# Altium schematic sheet My_PCB.SchDoc
size A2
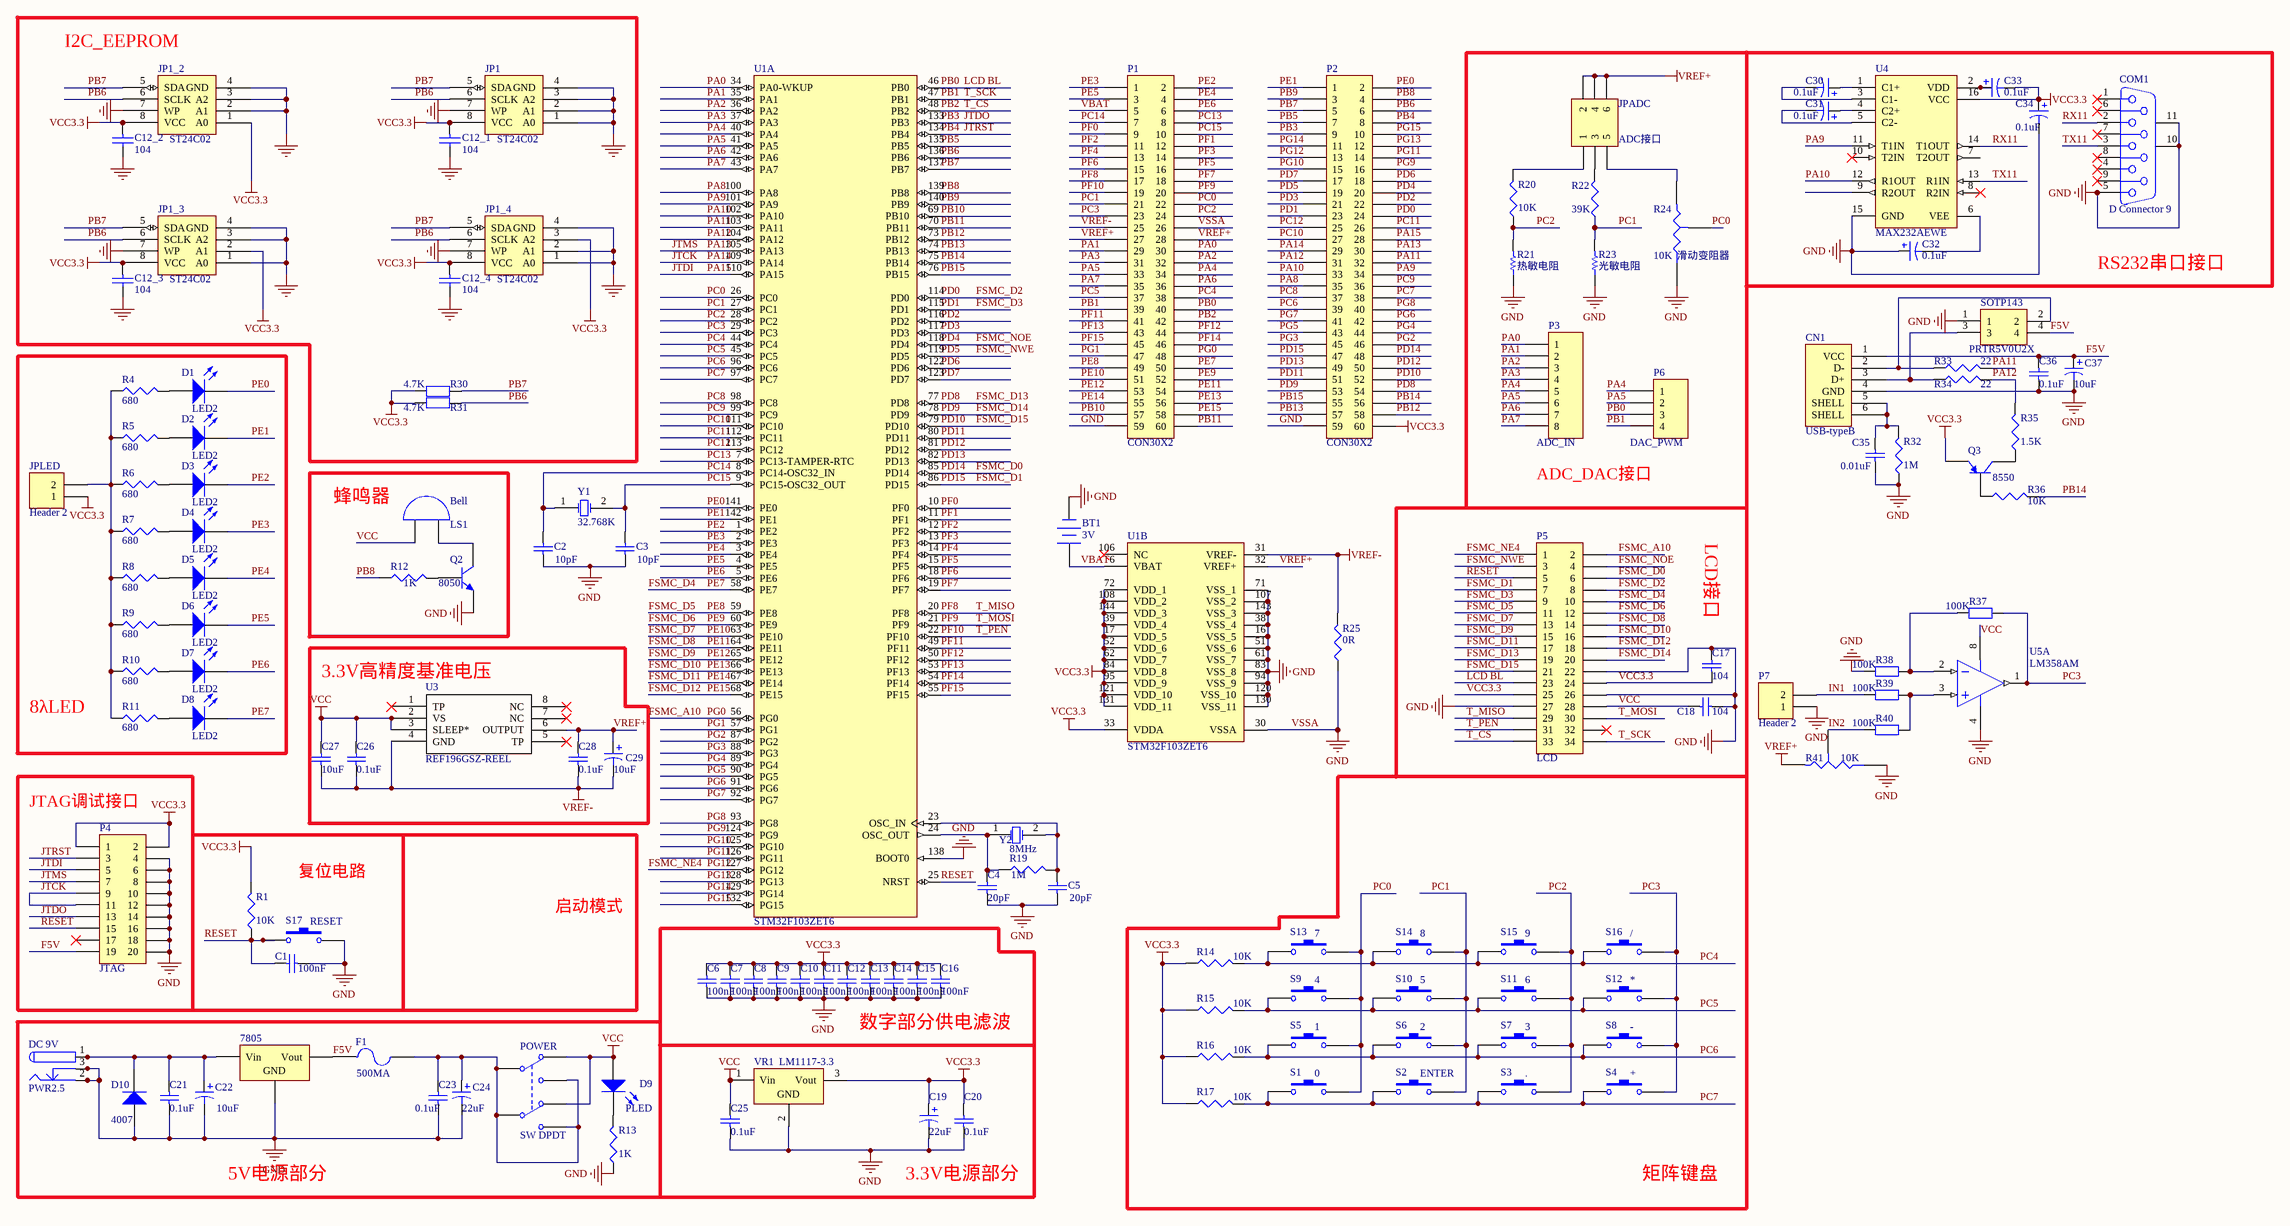
[diagram p0: My_PCB.SchDoc]

## Parts
7805  Volt Reg  [D2PAK_N]  (value not drawn)
BT1  3V  [BATTERY]
C1  value 100nF  [0805]  (hidden comment: Cap Semi)
C2  value 10pF  [0805]  (hidden comment: Cap Semi)
C3  value 10pF  [0805]  (hidden comment: Cap Semi)
C4  value 20pF  [0805]  (hidden comment: Cap Semi)
C5  value 20pF  [0805]  (hidden comment: Cap Semi)
C6  value 100nF  [0805]  (hidden comment: Cap Semi)
C7  value 100nF  [0805]  (hidden comment: Cap Semi)
C8  value 100nF  [0805]  (hidden comment: Cap Semi)
C9  value 100nF  [0805]  (hidden comment: Cap Semi)
C10  value 100nF  [0805]  (hidden comment: Cap Semi)
C11  value 100nF  [0805]  (hidden comment: Cap Semi)
C12  value 100nF  [0805]  (hidden comment: Cap Semi)
C12_1  104  [0805]
C12_2  104  [0805]
C12_3  104  [0805]
C12_4  104  [0805]
C13  value 100nF  [0805]  (hidden comment: Cap Semi)
C14  value 100nF  [0805]  (hidden comment: Cap Semi)
C15  value 100nF  [0805]  (hidden comment: Cap Semi)
C16  value 100nF  [0805]  (hidden comment: Cap Semi)
C17  value 104  [0805]  (hidden comment: Cap Semi)
C18  value 104  [0805]  (hidden comment: Cap Semi)
C19  value 22uF  [0805]  (hidden comment: Cap Pol3)
C20  value 0.1uF  [0805]  (hidden comment: Cap Semi)
C21  value 0.1uF  [0805]  (hidden comment: Cap Semi)
C22  value 10uF  [0805]  (hidden comment: Cap Pol3)
C23  value 0.1uF  [0805]  (hidden comment: Cap Semi)
C24  value 22uF  [0805]  (hidden comment: Cap Pol3)
C25  value 0.1uF  [0805]  (hidden comment: Cap Semi)
C26  value 0.1uF  [0805]  (hidden comment: Cap Semi)
C27  value 10uF  [0805]  (hidden comment: Cap Semi)
C28  value 0.1uF  [0805]  (hidden comment: Cap Semi)
C29  value 10uF  [0805]  (hidden comment: Cap Pol3)
C30  value 0.1uF  [0805]  (hidden comment: Cap Pol3)
C31  value 0.1uF  [0805]  (hidden comment: Cap Pol3)
C32  value 0.1uF  [0805]  (hidden comment: Cap Pol3)
C33  value 0.1uF  [0805]  (hidden comment: Cap Pol3)
C34  value 0.1uF  [0805]  (hidden comment: Cap Pol3)
C35  value 0.01uF  [0805]  (hidden comment: Cap)
C36  value 0.1uF  [0805]  (hidden comment: Cap)
C37  value 10uF  [0805]  (hidden comment: Cap Pol1)
CN1  USB-typeB  [USB-B]
COM1  D Connector 9  [DSUB1.385-2H9]
D1  LED2  [3.2X1.6X1.1]
D2  LED2  [3.2X1.6X1.1]
D3  LED2  [3.2X1.6X1.1]
D4  LED2  [3.2X1.6X1.1]
D5  LED2  [3.2X1.6X1.1]
D6  LED2  [3.2X1.6X1.1]
D7  LED2  [3.2X1.6X1.1]
D8  LED2  [3.2X1.6X1.1]
D9  PLED  [3.2X1.6X1.1]
D10  4007  [DO-41]
DC_9V  PWR2.5  [KLD-0202]
F1  500MA  [PIN-W2/E2.8]
JP1  ST24C02  [SO8]
JP1_2  ST24C02  [SO8]
JP1_3  ST24C02  [SO8]
JP1_4  ST24C02  [SO8]
JPADC  ADC接口  [HDR2X3]
JPLED  Header 2  [HDR1X2]
LS1  Bell  [BELL]
P1  CON30X2  [HDR2X30]
P2  CON30X2  [HDR2X30]
P3  ADC_IN  [HDR1X8]
P4  JTAG  [HDR2X10]
P5  LCD  [HDR2X17]
P6  DAC_PWM  [HDR1X4]
P7  Header 2  [HDR1X2]
POWER  SW DPDT  [DPDT-6]
Q2  8050  [TO-226-AA]
Q3  8550  [TO-92A]
R1  value 10K  [0805]  (hidden comment: Res3)
R4  value 680  [0805]  (hidden comment: Res3)
R5  value 680  [0805]  (hidden comment: Res3)
R6  value 680  [0805]  (hidden comment: Res3)
R7  value 680  [0805]  (hidden comment: Res3)
R8  value 680  [0805]  (hidden comment: Res3)
R9  value 680  [0805]  (hidden comment: Res3)
R10  value 680  [0805]  (hidden comment: Res3)
R11  value 680  [0805]  (hidden comment: Res3)
R12  value 1K  [0805]  (hidden comment: Res3)
R13  value 1K  [0805]  (hidden comment: Res3)
R14  value 10K  [0805]  (hidden comment: Res3)
R15  value 10K  [0805]  (hidden comment: Res3)
R16  value 10K  [0805]  (hidden comment: Res3)
R17  value 10K  [0805]  (hidden comment: Res3)
R19  value 1M  [0805]  (hidden comment: Res3)
R20  value 10K  [0805]  (hidden comment: Res3)
R21  热敏电阻  [AXIAL-0.5]
R22  value 39K  [0805]  (hidden comment: Res3)
R23  光敏电阻  [AXIAL-0.5]
R24  滑动变阻器  value 10K  [VR5]
R25  value 0R  [0805]  (hidden comment: Res3)
R30  value 4.7K  [0805]  (hidden comment: 10K)
R31  value 4.7K  [0805]  (hidden comment: 10K)
R32  value 1M  [0805]  (hidden comment: Res3)
R33  value 22  [0805]  (hidden comment: Res3)
R34  value 22  [0805]  (hidden comment: Res3)
R35  value 1.5K  [0805]  (hidden comment: Res3)
R36  value 10K  [0805]  (hidden comment: Res3)
R37  value 100K  [0805]  (hidden comment: Res2)
R38  value 100K  [0805]  (hidden comment: Res2)
R39  value 100K  [0805]  (hidden comment: Res2)
R40  value 100K  [0805]  (hidden comment: Res2)
R41  value 10K  [VR5]  (hidden comment: Res Tap)
S1  0  [KEYSB1]
S2  ENTER  [KEYSB1]
S3  .  [KEYSB1]
S4  +  [KEYSB1]
S5  1  [KEYSB1]
S6  2  [KEYSB1]
S7  3  [KEYSB1]
S8  -  [KEYSB1]
S9  4  [KEYSB1]
S10  5  [KEYSB1]
S11  6  [KEYSB1]
S12  *  [KEYSB1]
S13  7  [KEYSB1]
S14  8  [KEYSB1]
S15  9  [KEYSB1]
S16  /  [KEYSB1]
S17  RESET  [KEYSB1]
SOTP143  PRTR5V0U2X  [SOT-143_N]
U1  STM32F103ZET6  [LQFP144_N]  (parts A,B of 2)
U3  REF196GSZ-REEL  [R_8]
U4  MAX232AEWE  [WSO16_L]
U5  LM358AM  [M08A_N]  (part A of 2)
VR1_LM1117-3.3  Volt Reg  [LM1117]  (value not drawn)
Y1  32.768K  [R38]
Y2  8MHz  [XTAL]

## Blocks framed on the sheet
I2C_EEPROM: C12_1-C12_4 JP1 JP1_2-JP1_4 R30 R31
ADC_DAC接口: JPADC P3 P6 R20-R24
8λLED: D1-D8 JPLED R4-R11
蜂鸣器: LS1 Q2 R12
LCD接口: C17 C18 P5
3.3V高精度基准电压: C26-C29 U3
JTAG调试接口: P4
矩阵键盘: R14-R17 S1-S16
5V电源部分: 7805 C21-C24 D9 D10 DC_9V F1 POWER R13

## Nets
GND: 7805.2(GND) BT1.2(-) C1.1 C2.1 C3.1 C4.1 C5.1 C6.1 C7.1 C8.1 C9.1 C10.1 C11.1 C12.1 C12_1.2 C12_2.2 C12_3.2 C12_4.2 C13.1 C14.1 C15.1 C16.1 C17.2 C18.1 C19.2 C20.1 C21.1 C22.2 C23.1 C24.2 C25.1 C32.1 C34.2 C35.1 C36.1 C37.2 CN1.4(GND) COM1.5 COM1.10(MH1) COM1.11(MH2) D10.1(A) DC_9V.2 DC_9V.2A DC_9V.2B DC_9V.3 DC_9V.3A DC_9V.3B JP1.1(A0) JP1.2(A1) JP1.3(A2) JP1.4(GND) JP1.7(WP) JP1_2.2(A1) JP1_2.3(A2) JP1_2.4(GND) JP1_2.7(WP) JP1_3.1(A0) JP1_3.3(A2) JP1_3.4(GND) JP1_3.7(WP) JP1_4.1(A0) JP1_4.2(A1) JP1_4.4(GND) JP1_4.7(WP) P1.26 P1.59 P2.59 P4.4 P4.6 P4.8 P4.10 P4.12 P4.14 P4.16 P4.18 P4.20 P5.22 P5.26 P5.27 P7.1 Q2.3(E) R13.1 R21.1 R23.1 R24.2(B) R25.1 R32.1 R38.1 R41.2(B) S17.2 SOTP143.1 U1.16(VSS_5) U1.30(VSSA) U1.38(VSS_4) U1.51(VSS_6) U1.61(VSS_7) U1.71(VSS_1) U1.83(VSS_8) U1.94(VSS_9) U1.107(VSS_2) U1.120(VSS_10) U1.130(VSS_11) U1.138(BOOT0) U1.143(VSS_3) U4.15(GND) U5.4(GND) VR1_LM1117-3.3.2(GND)  [also labelled VSSA]
VCC: C18.2 C25.2 C26.2 C27.2 D9.1(A) LS1.1(A) P5.28 POWER.2(NC1) POWER.4(NC2) U3.2(VS) U3.3(SLEEP*) U5.8(V+) VR1_LM1117-3.3.1(Vin)
VCC3.3: C6.2 C7.2 C8.2 C9.2 C10.2 C11.2 C12.2 C12_1.1 C12_2.1 C12_3.1 C12_4.1 C13.2 C14.2 C15.2 C16.2 C17.1 C19.1 C20.2 C33.2 C34.1 JP1.8(VCC) JP1_2.1(A0) JP1_2.8(VCC) JP1_3.2(A1) JP1_3.8(VCC) JP1_4.3(A2) JP1_4.8(VCC) JPLED.1 P2.60 P4.1 P4.2 P5.24 P5.25 Q3.1(E) R1.2 R14.1 R15.1 R16.1 R17.1 R30.1 R31.1 U1.17(VDD_5) U1.33(VDDA) U1.39(VDD_4) U1.52(VDD_6) U1.62(VDD_7) U1.72(VDD_1) U1.84(VDD_8) U1.95(VDD_9) U1.108(VDD_2) U1.121(VDD_10) U1.131(VDD_11) U1.144(VDD_3) U4.16(VCC) VR1_LM1117-3.3.3(Vout)
VREF+: C28.2 C29.1 JPADC.2 JPADC.4 JPADC.6 P1.27 P1.28 R41.1(A) U1.32(VREF+) U3.6(OUTPUT)
VREF-: C26.1 C27.1 C28.1 C29.2 P1.25 R25.2 U1.31(VREF-) U3.4(GND)
F5V: 7805.3(Vout) C36.2 C37.1 CN1.1(VCC) F1.1 P4.19 SOTP143.4
FSMC_A10: P1.48 P5.2 U1.56(PG0)  [also labelled PG0]
FSMC_D0: P2.48 P5.6 U1.85(PD14)  [also labelled PD14]
FSMC_D1: P2.47 P5.7 U1.86(PD15)  [also labelled PD15]
FSMC_D2: P2.24 P5.8 U1.114(PD0)  [also labelled PD0]
FSMC_D3: P2.23 P5.9 U1.115(PD1)  [also labelled PD1]
FSMC_D4: D8.2(K) P1.50 P5.10 U1.58(PE7)  [also labelled PE7]
FSMC_D5: P1.49 P5.11 U1.59(PE8)  [also labelled PE8]
FSMC_D6: P1.52 P5.12 U1.60(PE9)  [also labelled PE9]
FSMC_D7: P1.51 P5.13 U1.63(PE10)  [also labelled PE10]
FSMC_D8: P1.54 P5.14 U1.64(PE11)  [also labelled PE11]
FSMC_D9: P1.53 P5.15 U1.65(PE12)  [also labelled PE12]
FSMC_D10: P1.56 P5.16 U1.66(PE13)  [also labelled PE13]
FSMC_D11: P1.55 P5.17 U1.67(PE14)  [also labelled PE14]
FSMC_D12: P1.58 P5.18 U1.68(PE15)  [also labelled PE15]
FSMC_D13: P2.54 P5.19 U1.77(PD8)  [also labelled PD8]
FSMC_D14: P2.53 P5.20 U1.78(PD9)  [also labelled PD9]
FSMC_D15: P2.52 P5.21 U1.79(PD10)  [also labelled PD10]
FSMC_NE4: P2.13 P5.1 U1.127(PG12)  [also labelled PG12]
FSMC_NOE: P2.20 P5.4 U1.118(PD4)  [also labelled PD4]
FSMC_NWE: P2.19 P5.3 U1.119(PD5)  [also labelled PD5]
IN1: P7.2 R39.1
IN2: R40.1 R41.3(TAP)
JTCK: P2.29 P4.9 P4.11 U1.109(PA14)  [also labelled PA14]
JTDI: P2.28 P4.5 U1.110(PA15)  [also labelled PA15]
JTDO: P2.9 P4.13 U1.133(PB3)  [also labelled PB3]
JTMS: P2.30 P4.7 U1.105(PA13)  [also labelled PA13]
JTRST: P2.8 P4.3 U1.134(PB4)  [also labelled PB4]
LCD BL: P1.40 P5.23 P6.3 U1.46(PB0)  [also labelled PB0]
PA0: P1.30 P3.1 U1.34(PA0-WKUP)
PA1: P1.29 P3.2 U1.35(PA1)
PA2: P1.32 P3.3 U1.36(PA2)
PA3: P1.31 P3.4 U1.37(PA3)
PA4: P1.34 P3.5 P6.1 U1.40(PA4)
PA5: P1.33 P3.6 P6.2 U1.41(PA5)
PA6: P1.36 P3.7 U1.42(PA6)
PA7: P1.35 P3.8 U1.43(PA7)
PA8: P2.35 U1.100(PA8)
PA9: P2.34 U1.101(PA9) U4.11(T1IN)
PA10: P2.33 U1.102(PA10) U4.12(R1OUT)
PA11: P2.32 R33.2 U1.103(PA11)
PA12: P2.31 R34.2 R35.2 U1.104(PA12)
PB1: P1.39 P5.34 P6.4 U1.47(PB1)  [also labelled T_SCK]
PB2: P1.42 P5.33 U1.48(PB2)  [also labelled T_CS]
PB5: P2.7 U1.135(PB5)
PB6: JP1.6(SCLK) JP1_2.6(SCLK) JP1_3.6(SCLK) JP1_4.6(SCLK) P2.6 R31.2 U1.136(PB6)
PB7: JP1.5(SDA) JP1_2.5(SDA) JP1_3.5(SDA) JP1_4.5(SDA) P2.5 R30.2 U1.137(PB7)
PB8: P2.4 R12.1 U1.139(PB8)
PB9: P2.3 U1.140(PB9)
PB10: P1.57 U1.69(PB10)
PB11: P1.60 U1.70(PB11)
PB12: P2.58 U1.73(PB12)
PB13: P2.57 U1.74(PB13)
PB14: P2.56 R36.2 U1.75(PB14)
PB15: P2.55 U1.76(PB15)
PC0: P1.22 R24.3(TAP) S1.2 S5.2 S9.2 S13.2 U1.26(PC0)
PC1: P1.21 R22.1 R23.2 S2.2 S6.2 S10.2 S14.2 U1.27(PC1)
PC2: P1.24 R20.1 R21.2 S3.2 S7.2 S11.2 S15.2 U1.28(PC2)
PC3: P1.23 R37.2 S4.2 S8.2 S12.2 S16.2 U1.29(PC3) U5.1(OUTA)
PC4: P1.38 R14.2 S13.1 S14.1 S15.1 S16.1 U1.44(PC4)
PC5: P1.37 R15.2 S9.1 S10.1 S11.1 S12.1 U1.45(PC5)
PC6: P2.39 R16.2 S5.1 S6.1 S7.1 S8.1 U1.96(PC6)
PC7: P2.38 R17.2 S1.1 S2.1 S3.1 S4.1 U1.97(PC7)
PC8: P2.37 U1.98(PC8)
PC9: P2.36 U1.99(PC9)
PC10: P2.27 U1.111(PC10)
PC11: P2.26 U1.112(PC11)
PC12: P2.25 U1.113(PC12)
PC13: P1.8 U1.7(PC13-TAMPER-RTC)
PC14: C2.2 P1.7 U1.8(PC14-OSC32_IN) Y1.1(OSC1)
PC15: C3.2 P1.10 U1.9(PC15-OSC32_OUT) Y1.2(OSC2)
PD2: P2.22 U1.116(PD2)
PD3: P2.21 U1.117(PD3)
PD6: P2.18 U1.122(PD6)
PD7: P2.17 U1.123(PD7)
PD11: P2.51 U1.80(PD11)
PD12: P2.50 U1.81(PD12)
PD13: P2.49 U1.82(PD13)
PE0: D1.2(K) P2.2 U1.141(PE0)
PE1: D2.2(K) P2.1 U1.142(PE1)
PE2: D3.2(K) P1.2 U1.1(PE2)
PE3: D4.2(K) P1.1 U1.2(PE3)
PE4: D5.2(K) P1.4 U1.3(PE4)
PE5: D6.2(K) P1.3 U1.4(PE5)
PE6: D7.2(K) P1.6 U1.5(PE6)
PF0: P1.9 U1.10(PF0)
PF1: P1.12 U1.11(PF1)
PF2: P1.11 U1.12(PF2)
PF3: P1.14 U1.13(PF3)
PF4: P1.13 U1.14(PF4)
PF5: P1.16 U1.15(PF5)
PF6: P1.15 U1.18(PF6)
PF7: P1.18 U1.19(PF7)
PF8: P1.17 P5.29 U1.20(PF8)  [also labelled T_MISO]
PF9: P1.20 P5.30 U1.21(PF9)  [also labelled T_MOSI]
PF10: P1.19 P5.31 U1.22(PF10)  [also labelled T_PEN]
PF11: P1.41 U1.49(PF11)
PF12: P1.44 U1.50(PF12)
PF13: P1.43 U1.53(PF13)
PF14: P1.46 U1.54(PF14)
PF15: P1.45 U1.55(PF15)
PG1: P1.47 U1.57(PG1)
PG2: P2.46 U1.87(PG2)
PG3: P2.45 U1.88(PG3)
PG4: P2.44 U1.89(PG4)
PG5: P2.43 U1.90(PG5)
PG6: P2.42 U1.91(PG6)
PG7: P2.41 U1.92(PG7)
PG8: P2.40 U1.93(PG8)
PG9: P2.16 U1.124(PG9)
PG10: P2.15 U1.125(PG10)
PG11: P2.14 U1.126(PG11)
PG13: P2.12 U1.128(PG13)
PG14: P2.11 U1.129(PG14)
PG15: P2.10 U1.132(PG15)
RESET: C1.2 P4.15 P5.5 R1.1 S17.1 U1.25(NRST)
RX11: COM1.2 U4.14(T1OUT)
TX11: COM1.3 U4.13(R1IN)
VBAT: BT1.1(+) P1.5 U1.6(VBAT)
Net7805_1: 7805.1(Vin) C21.2 C22.1 D10.2(K) DC_9V.1 DC_9V.1A DC_9V.1B
NetC4_2: C4.2 R19.1 U1.24(OSC_OUT) Y2.1(OSC1)
NetC5_2: C5.2 R19.2 U1.23(OSC_IN) Y2.2(OSC2)
NetC23_2: C23.2 C24.1 F1.2 POWER.1(COMMON1) POWER.3(NO1) POWER.5(COMMON2) POWER.6(NO2)
NetC30_1: C30.1 U4.1(C1+)
NetC30_2: C30.2 U4.3(C1-)
NetC31_1: C31.1 U4.4(C2+)
NetC31_2: C31.2 U4.5(C2-)
NetC32_2: C32.2 U4.6(VEE)
NetC33_1: C33.1 U4.2(VDD)
NetC35_2: C35.2 CN1.5(SHELL) CN1.6(SHELL) R32.2
NetCN1_2: CN1.2(D-) R33.1 SOTP143.2
NetCN1_3: CN1.3(D+) R34.1 SOTP143.3
NetD1_1: D1.1(A) R4.2
NetD2_1: D2.1(A) R5.2
NetD3_1: D3.1(A) R6.2
NetD4_1: D4.1(A) R7.2
NetD5_1: D5.1(A) R8.2
NetD6_1: D6.1(A) R9.2
NetD7_1: D7.1(A) R10.2
NetD8_1: D8.1(A) R11.2
NetD9_2: D9.2(K) R13.2
NetJPADC_1: JPADC.1 R20.2
NetJPADC_3: JPADC.3 R22.2
NetJPADC_5: JPADC.5 R24.1(A)
NetJPLED_2: JPLED.2 R4.1 R5.1 R6.1 R7.1 R8.1 R9.1 R10.1 R11.1
NetLS1_2: LS1.2(B) Q2.1(C)
NetQ2_2: Q2.2(B) R12.2
NetQ3_2: Q3.2(B) R36.1
NetQ3_3: Q3.3(C) R35.1
NetR37_1: R37.1 R38.2 U5.2(INA-)
NetR39_2: R39.2 R40.2 U5.3(INA+)

Not connected (* = marked no-connect by the designer): COM1 1* 4* 6* 7* 8* 9*; P4 17*; P5 32*; U1 106(NC)*; U3 1(TP)* 5(TP)* 7(NC)* 8(NC)*; U4 7(T2OUT) 8(R2IN)* 9(R2OUT) 10(T2IN)*

## Notes on the sheet
- RS232串口接口
- 复位电路
- 启动模式
- 数字部分供电滤波
- 3.3V电源部分

## Library data of the parts
7805 = Volt Reg: Voltage Regulator; Published: 24-Mar-1999; LatestRevisionDate: 29-May-2009; LatestRevisionNote: IPC-7351 Footprint Added.; PackageReference: D2PAK; Publisher: Altium Limited; PackageDescription: 3-Pin Transistor Outline Package 2.54 mm Pitch, 15.1 mm Lead Span
BT1 = Battery: Multicell Battery; Published: 24-Mar-1999; LatestRevisionDate: 17-Jul-2002; LatestRevisionNote: Re-released for DXP Platform.; PackageReference: BAT-2; Publisher: Altium Limited; PackageDescription: Battery; 2 Leads
C1-C18 C20 C21 C23 C25-C28 = Cap Semi: Capacitor (Semiconductor SIM Model); Published: 8-Jun-2000; LatestRevisionDate: 29-May-2009; LatestRevisionNote: IPC-7351 Footprint Added.; PackageReference: C1206; Publisher: Altium Limited; PackageDescription: Chip Capacitor
C12_1-C12_4 = CAP: Capacitor
C19 C22 C24 C29-C34 = Cap Pol3: Polarized Capacitor (Surface Mount); Published: 8-Jun-2000; LatestRevisionDate: 29-May-2009; LatestRevisionNote: IPC-7351 Footprint Added.; PackageReference: C0805; Publisher: Altium Limited; PackageDescription: Chip Capacitor
C35 C36 = Cap: Capacitor; Published: 8-Jun-2000; LatestRevisionDate: 17-Jul-2002; LatestRevisionNote: Re-released for DXP Platform.; PackageReference: RAD-0.3; Publisher: Altium Limited; PackageDescription: Radial Cap, Thru-Hole; 2 Leads; 0.3 in Pin Spacing
C37 = Cap Pol1: Polarized Capacitor (Radial); Published: 8-Jun-2000; LatestRevisionDate: 17-Jul-2002; LatestRevisionNote: Re-released for DXP Platform.; PackageReference: RB7.6-15; Publisher: Altium Limited; PackageDescription: Polarized Capacitor (Radial); 2 Leads
CN1 = USB-B
COM1 = D Connector 9: Receptacle Assembly, 9 Position, Right Angle; PackageDocument: O; Positions: 9; Published: 15-Jun-2001; LatestRevisionDate: 17-Jul-2002; LatestRevisionNote: Re-released for DXP Platform.; DatasheetDocument: 1-Sep-1999; PackageReference: 788750; Publisher: Altium Limited; Orientation: Right Angle; Gender: Receptacle
D1-D9 = LED2: Typical RED, GREEN, YELLOW, AMBER GaAs LED; Published: 8-Jun-2000; LatestRevisionDate: 17-Jul-2002; LatestRevisionNote: Re-released for DXP Platform.; PackageVersion: Feb-2002; PackageReference: 3.2X1.6X1.1; Publisher: Altium Limited; PackageDescription: SM LED; 2 Flat Leads
D10 = Diode: Default Diode; Published: 8-Jun-2000; LatestRevisionDate: 17-Jul-2002; LatestRevisionNote: Re-released for DXP Platform.; PackageVersion: Sep-1996; PackageReference: SMC; Publisher: Altium Limited; PackageDescription: DO-214-AB/SMC; 2 C-Bend Leads; Body 7.9 x 5.9 mm, inc. leads (LxW); Code_JEDEC: DO-214-AB
DC_9V = PWR2.5: Low Voltage Power Supply Connector; Published: 17-Dec-2003; DatasheetDocument: 09-May-2002; Publisher: Altium Limited; ComponentLink1Description: Manufacturer Link; ComponentLink1URL: http://domino.kycon.com/internet/Products.html
F1 = Fuse 2: Fuse; Published: 8-Jun-2000; LatestRevisionDate: 17-Jul-2002; LatestRevisionNote: Re-released for DXP Platform.; PackageReference: PIN-W2/E2.8; Publisher: Altium Limited; PackageDescription: Thru-Hole; 2 Leads
JP1 JP1_2-JP1_4 = 24C02
JPADC = Header 3X2: Header, 3-Pin, Dual row; LatestRevisionDate: 17-Jul-2002; LatestRevisionNote: Re-released for DXP Platform.; Publisher: Altium Limited
JPLED P7 = Header 2: Header, 2-Pin; LatestRevisionDate: 17-Jul-2002; LatestRevisionNote: Re-released for DXP Platform.; Publisher: Altium Limited
LS1 = Bell: Electrical Bell; Published: 24-Mar-1999; LatestRevisionDate: 17-Jul-2002; LatestRevisionNote: Re-released for DXP Platform.; PackageReference: PIN2; Publisher: Altium Limited
P1 P2 = Header 30X2: Header, 30-Pin, Dual row; LatestRevisionDate: 17-Jul-2002; LatestRevisionNote: Re-released for DXP Platform.; Publisher: Altium Limited
P3 = Header 8: Header, 8-Pin; LatestRevisionDate: 17-Jul-2002; LatestRevisionNote: Re-released for DXP Platform.; Publisher: Altium Limited
P4 = Header 10X2: Header, 10-Pin, Dual row; LatestRevisionDate: 17-Jul-2002; LatestRevisionNote: Re-released for DXP Platform.; Publisher: Altium Limited
P5 = Header 17X2: Header, 17-Pin, Dual row; LatestRevisionDate: 17-Jul-2002; LatestRevisionNote: Re-released for DXP Platform.; Publisher: Altium Limited
P6 = Header 4: Header, 4-Pin; LatestRevisionDate: 17-Jul-2002; LatestRevisionNote: Re-released for DXP Platform.; Publisher: Altium Limited
POWER = SW DPDT: Switch; Published: 24-Mar-1999; LatestRevisionDate: 29-May-2009; LatestRevisionNote: IPC-7351 Footprint Added.; PackageVersion: Mar-2001; PackageReference: SOT23-6; Publisher: Altium Limited; PackageDescription: 6-Pin SOT-23 Package 0.95 mm Pitch, 2.7 mm Lead Span; Code_JEITA: SC-74; Code_IPC: SOT26A-6
Q2 = NPN: NPN Bipolar Transistor; Published: 8-Jun-2000; LatestRevisionDate: 17-Jul-2002; LatestRevisionNote: Re-released for DXP Platform.; PackageReference: TO-226-AA; Publisher: Altium Limited; PackageDescription: TO, Flat Index; 3 In-Line, Axial Leads; Body Dia. 4.8mm; Leads 0.55 x 0.51 mm (max); Code_JEDEC: TO-226-AA
Q3 = 2N3906: PNP General Purpose Amplifier; Published: 8-Jun-2000; LatestRevisionDate: 15-Jan-2003; LatestRevisionNote: PCB Footprint 'BCY-W3/D4.7' replaced; DatasheetVersion: 1997; PackageVersion: Sep-1998; PackageReference: TO-92A; Publisher: Altium Limited; PackageDescription: TO, Flat Index; 3 In-Line, Axial Leads; Body Dia. 4.5mm; Leads 0.51 x 0.48 mm (max); ComponentLink1Description: Manufacturer Link; ComponentLink1URL: http://www.fairchildsemi.com/; ComponentLink2Description: Datasheet; ComponentLink2URL: http://www.fairchildsemi.com/ds/2N%2F2N3906.pdf
R1 R4-R17 R19 R20 R22 R25 R32-R36 = Res3: Resistor; Published: 8-Jun-2000; LatestRevisionDate: 29-May-2009; LatestRevisionNote: IPC-7351 Footprint Added.; PackageReference: J1-0603; Publisher: Altium Limited; PackageDescription: Chip Resistor
R21 = Res Semi: Semiconductor Resistor; Published: 8-Jun-2000; LatestRevisionDate: 17-Jul-2002; LatestRevisionNote: Re-released for DXP Platform.; PackageReference: AXIAL-0.5; Publisher: Altium Limited; PackageDescription: Axial Device, Thru-Hole; 2 Leads; 0.5 in Pin Spacing
R23 = Res Semi: Semiconductor Resistor; Value: 1K; Published: 8-Jun-2000; LatestRevisionDate: 17-Jul-2002; LatestRevisionNote: Re-released for DXP Platform.; PackageReference: AXIAL-0.5; Publisher: Altium Limited; PackageDescription: Axial Device, Thru-Hole; 2 Leads; 0.5 in Pin Spacing
R24 R41 = Res Tap: Tapped Resistor; pin to pad: 2>3 3>2; Sim Note: Enter the Resistance value and the set point into parameter fields.; Set Position: 0.5; Published: 24-Mar-1999; LatestRevisionDate: 17-Jul-2002; LatestRevisionNote: Re-released for DXP Platform.; PackageReference: VR3; Publisher: Altium Limited; PackageDescription: Variable Resistor, Thru-Hole; 3 Leads
R30 R31 = Res2: Published: 8-Jun-2000; LatestRevisionDate: 17-Jul-2002; LatestRevisionNote: Re-released for DXP Platform.; PackageReference: AXIAL-0.4; Publisher: Altium Limited
R37-R40 = Res2: Resistor; Published: 8-Jun-2000; LatestRevisionDate: 17-Jul-2002; LatestRevisionNote: Re-released for DXP Platform.; PackageReference: AXIAL-0.4; Publisher: Altium Limited; PackageDescription: Axial Device, Thru-Hole; 2 Leads; 0.4 in Pin Spacing
S1-S17 = SW-PB: Switch; Published: 24-Mar-1999; LatestRevisionDate: 17-Jul-2002; LatestRevisionNote: Re-released for DXP Platform.; PackageReference: SPST-2; Publisher: Altium Limited; PackageDescription: Switch; 2 Leads
SOTP143 = Header 2X2: Header, 2-Pin, Dual row; LatestRevisionDate: 17-Jul-2002; LatestRevisionNote: Re-released for DXP Platform.; Publisher: Altium Limited
U1 = STM32F103ZET6: STM32 ARM-based 32-bit MCU Performance Line with 512 kB Flash, 64 kB Internal RAM, -40 to +85°C Temperature, 144-Pin LQFP, Tray; DatasheetVersion: rev8.0, Apr-2011; PackageVersion: 2011; PackageReference: LQFP144; PackageDescription: 144-Pin Thin Quad Flat Pack 0.5 mm Pitch; ComponentLink1Description: Manufacturer URL; ComponentLink1URL: http://www.st.com/; ComponentLink2Description: STM32F103 Datasheet; ComponentLink2URL: http://www.st.com/internet/com/TECHNICAL_RESOURCES/TECHNICAL_LITERATURE/DATASHEET/CD00191185.pdf; ComponentLink3Description: STM32 Family Web Page; ComponentLink3URL: www.st.com/stm32
U3 = REF196GSZ-REEL: Imported; Manufacturer_Part_Number: REF196GSZ-REEL; Vendor: Vendor; RefDes: RefDes; Type: DEV; Value: Value
U4 = MAX232AEWE: +5V Powered, Multi-Channel RS-232 Driver/Receiver; Published: 16-Jan-2001; LatestRevisionDate: 13-Apr-2006; LatestRevisionNote: IPC-7351 Footprint Added.; PackageReference: WSO16; Publisher: Altium Limited; PackageDescription: 16-Pin Small Outline Integrated Circuit 1.27 mm Pitch; Code_JEDEC: MS-013-AA; Code_IPC: SOIC127P1030-16; ComponentLink1Description: Manufacturer Link; ComponentLink1URL: http://www.maxim-ic.com/; ComponentLink2Description: Datasheet; ComponentLink2URL: http://pdfserv.maxim-ic.com/en/ds/MAX220-MAX249.pdf
U5 = LM358AM: Low Power Dual Operational Amplifier; Manufacturer: National Semiconductor; CompType: Amplifiers; PackageTopMarking: NSZXTT*LM*358AM; PowerWise: N; Published: 4-Dec-2008; LatestRevisionDate: 13-Jan-2009; LatestRevisionNote: Sim Model Added.; DatasheetVersion: Oct-2005; PackageVersion: revL, Sep-2006; PackageReference: M08A; Publisher: Altium Limited; PackageDescription: SOIC Narrow, 4.9 x 3.9 x 1.45mm, 8 Lead, 1.27mm Pitch; PartNumber: LM358AM; RoHS: O; PinCount: 8; DigiKeyPartNumber: LM358AMXCT-ND; Code_JEDEC: MS-012-AA; Code_IPC: SOIC127P600-8; ComponentLink1Description: LM358 Datasheet; ComponentLink1URL: http://www.national.com/ds/LM/LM358.pdf; ComponentLink2Description: LM358 Web Page; ComponentLink2URL: http://www.national.com/pf/LM/LM358.html; ComponentLink3Description: M08A Package Page; ComponentLink3URL: http://www.national.com/packaging/folders/m08a.html
VR1_LM1117-3.3 = Volt Reg: Voltage Regulator; pin to pad: 1>3 2>1 3>2; Published: 24-Mar-1999; LatestRevisionDate: 29-May-2009; LatestRevisionNote: IPC-7351 Footprint Added.; PackageReference: D2PAK; Publisher: Altium Limited; PackageDescription: 3-Pin Transistor Outline Package 2.54 mm Pitch, 15.1 mm Lead Span
Y1 Y2 = XTAL: Crystal Oscillator; Published: 8-Jun-2000; LatestRevisionDate: 17-Jul-2002; LatestRevisionNote: Re-released for DXP Platform.; PackageReference: R38; Publisher: Altium Limited; PackageDescription: Crystal, Thru-Hole; 2 Leads; Body 3.1 x 8.2 mm (Dia.xH)